# EAGLE design ardu_heli_small (EAGLE 5.06)
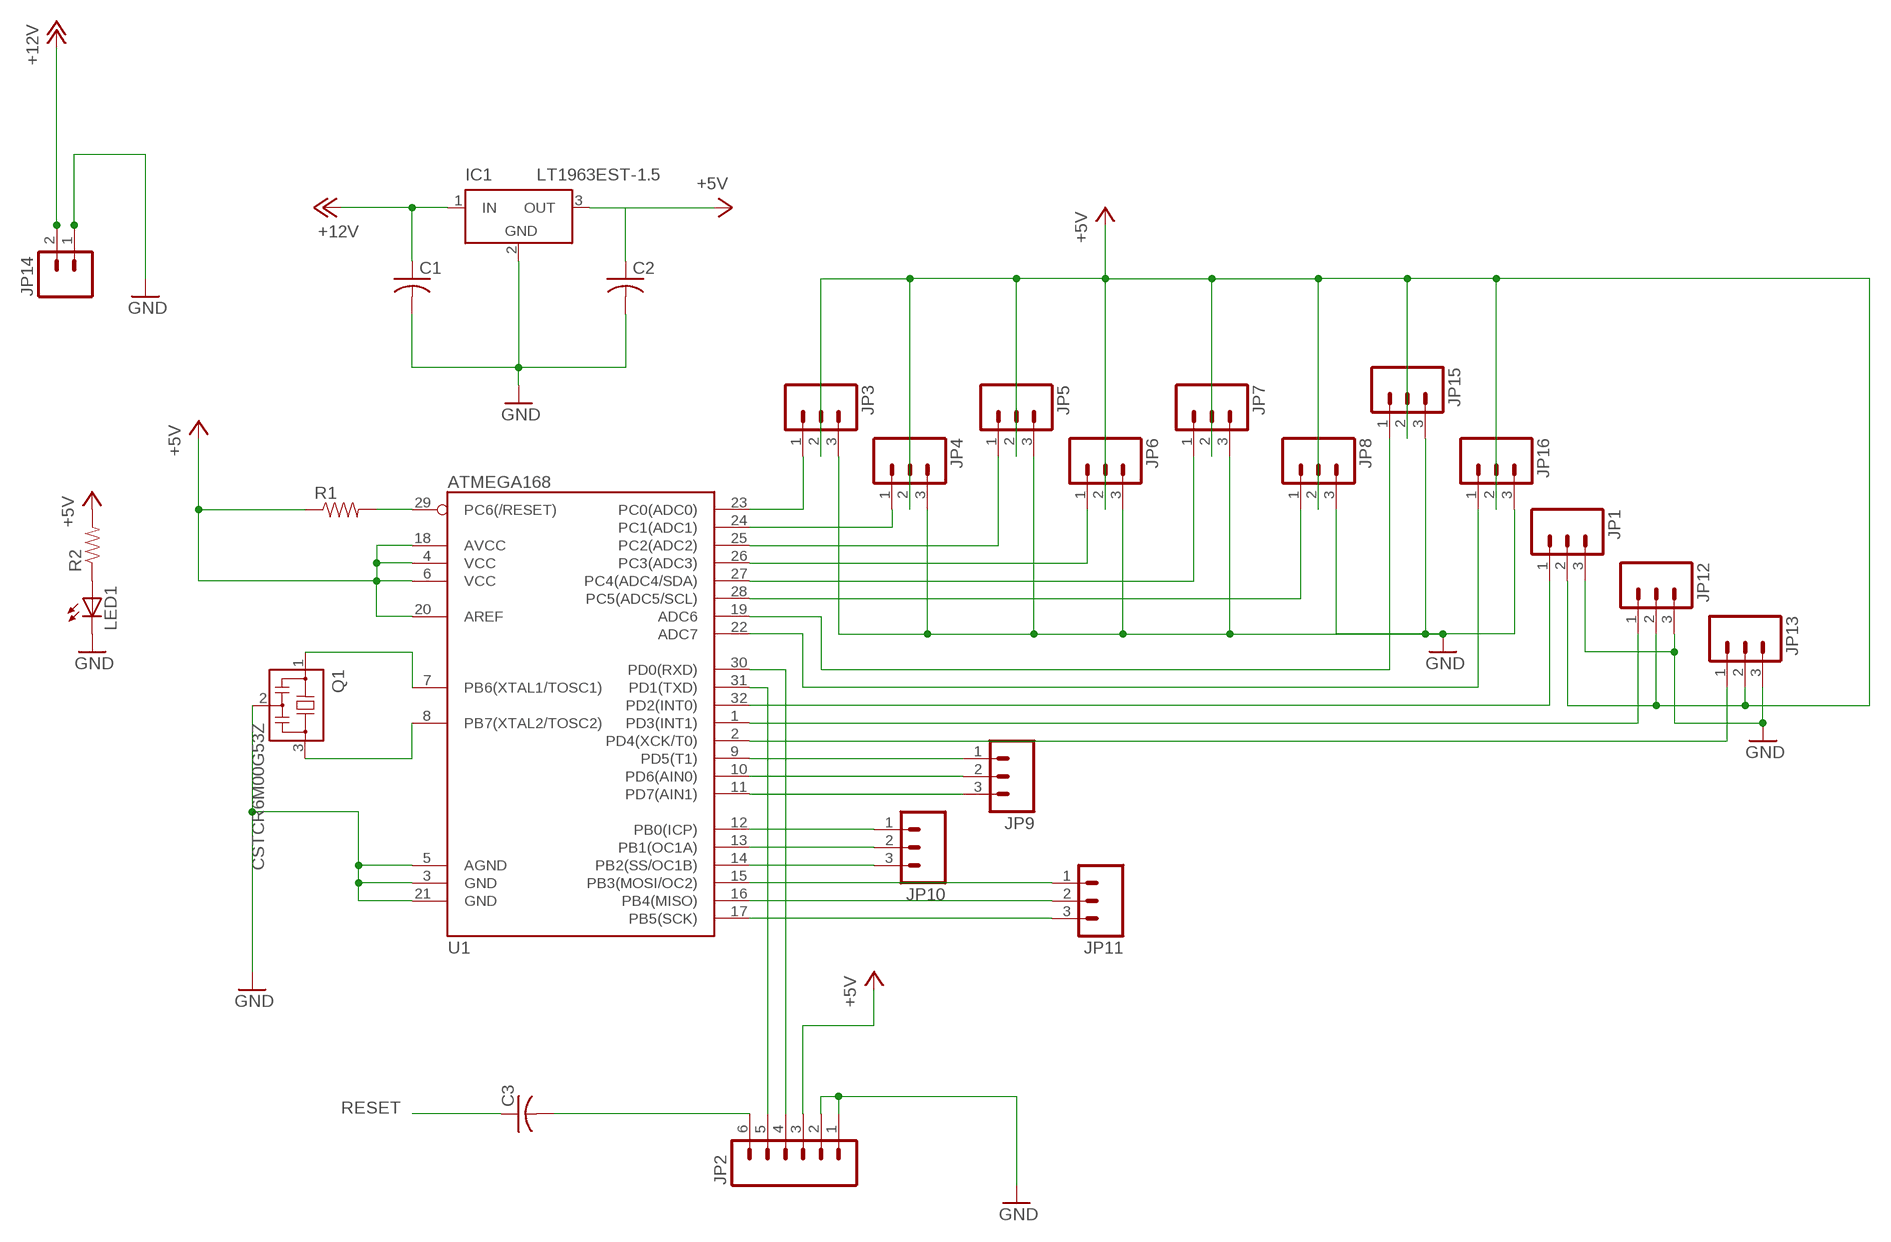
[diagram p0: schematic, sheet 1]

## Parts
C1  C-USC1206  [C1206]
C2  C-USC1206  [C1206]
C3  C-USC1812K  [C1812K]
IC1  LT1963EST-1.5  [SOT223]
JP1  M03PTH  [1X03]
JP2  M06SIP  [1X06]
JP3  M03PTH  [1X03]
JP4  M03PTH  [1X03]
JP5  M03PTH  [1X03]
JP6  M03PTH  [1X03]
JP7  M03PTH  [1X03]
JP8  M03PTH  [1X03]
JP9  M03PTH  [1X03]
JP10  M03PTH  [1X03]
JP11  M03PTH  [1X03]
JP12  M03PTH  [1X03]
JP13  M03PTH  [1X03]
JP14  M02PTH  [1X02]
JP15  M03PTH  [1X03]
JP16  M03PTH  [1X03]
LED1  LED1206  [LED-1206]
Q1  CSTCR6M00G53Z  [CSTCR6M]
R1  RESISTOR1206  [1206]
R2  RESISTOR1206  [1206]
U1  ATMEGA168  [TQFP32-08]

## Nets
+5V: C2.1 IC1.3(OUT) JP1.2 JP2.3 JP3.2 JP4.2 JP5.2 JP6.2 JP7.2 JP8.2 JP12.2 JP13.2 JP15.2 JP16.2 R1.1 R2.2 U1.4(VCC) U1.6(VCC) U1.18(AVCC) U1.20(AREF)
+12V: C1.1 IC1.1(IN) JP14.2
GND: C1.2 C2.2 IC1.2(GND) JP1.3 JP2.1 JP2.2 JP3.3 JP4.3 JP5.3 JP6.3 JP7.3 JP8.3 JP12.3 JP13.3 JP14.1 JP15.3 JP16.3 LED1.C Q1.2 U1.3(GND) U1.5(AGND) U1.21(GND)
N$1: Q1.3 U1.8(PB7(XTAL2/TOSC2))
N$2: Q1.1 U1.7(PB6(XTAL1/TOSC1))
N$3: JP3.1 U1.23(PC0(ADC0))
N$4: JP4.1 U1.24(PC1(ADC1))
N$5: JP2.4 U1.30(PD0(RXD))
N$6: JP12.1 U1.1(PD3(INT1))
N$7: JP2.5 U1.31(PD1(TXD))
N$8: JP1.1 U1.32(PD2(INT0))
N$9: JP5.1 U1.25(PC2(ADC2))
N$10: JP6.1 U1.26(PC3(ADC3))
N$11: JP7.1 U1.27(PC4(ADC4/SDA))
N$12: JP8.1 U1.28(PC5(ADC5/SCL))
N$14: JP13.1 U1.2(PD4(XCK/T0))
N$15: JP9.1 U1.9(PD5(T1))
N$16: JP9.2 U1.10(PD6(AIN0))
N$17: JP9.3 U1.11(PD7(AIN1))
N$18: JP10.1 U1.12(PB0(ICP))
N$19: JP10.2 U1.13(PB1(OC1A))
N$20: JP10.3 U1.14(PB2(SS/OC1B))
N$21: JP11.1 U1.15(PB3(MOSI/OC2))
N$22: JP11.2 U1.16(PB4(MISO))
N$23: JP11.3 U1.17(PB5(SCK))
N$24: LED1.A R2.1
N$28: C3.2 JP2.6
N$31: JP15.1 U1.19(ADC6)
N$33: JP16.1 U1.22(ADC7)
RESET: C3.1 R1.2 U1.29(PC6(/RESET))

## Power pins joined to a net without a drawn wire
GND: IC1.4(GND)

## Library data of the parts
C1-C3 = rcl:C-US: CAPACITOR, American symbol
IC1 = linear-technology:LT1963EST: 1.5A, Low Noise, Fast Transient Response LDO Regulator Source: http://www.linear.com/pc/downloadDocument.do?navId=H0,C3,P2222,D3148
JP1 JP3-JP13 JP15 JP16 = SparkFun:M03: Header 3 Standard 3-pin 0.1" header. Use with straight break away headers (SKU : PRT-00116), right angle break away headers (PRT-00553), swiss pins (PRT-00743), machine pins (PRT-00117), and female headers (PRT-00115). Molex polarized connector foot print use with SKU : PRT-08232 with associated crimp pins and housings.
JP2 = SparkFun:M06: Header 6 Standard 6-pin 0.1" header. Use with straight break away headers (SKU : PRT-00116), right angle break away headers (PRT-00553), swiss pins (PRT-00743), machine pins (PRT-00117), and female headers (PRT-00115). Molex polarized connector foot print use with SKU : PRT-08094 with associated crimp pins and housings. NOTES ON THE VARIANTS LOCK and LOCK_LONGPADS... This footprint was designed to help hold the alignment of a through-hole component (i.e. 6-pin header) while soldering it into place. You may notice that each hole has been shifted either up or down by 0.005 of an inch from it's more standard position (which is a perfectly straight line). This slight alteration caused the pins (the squares in the middle) to touch the edges of the holes. Because they are alternating, it causes a "brace" to hold the component in place. 0.005 has proven to be the perfect amount of "off-center" position when using our standard breakaway headers. Although looks a little odd when you look at the bare footprint, once you have a header in there, the alteration is very hard to notice. Also, if you push a header all the way into place, it is covered up entirely on the bottom side. This idea of altering the position of holes to aid alignment will be further integrated into the Sparkfun Library for other footprints. It can help hold any component with 3 or more connection pins.
JP14 = SparkFun:M02: Header 2 Standard 2-pin 0.1" header. Use with straight break away headers (SKU : PRT-00116), right angle break away headers (PRT-00553), swiss pins (PRT-00743), machine pins (PRT-00117), and female headers (PRT-00115). Molex polarized connector foot print use with SKU : PRT-08233 with associated crimp pins and housings.
LED1 = SparkFun:LED: LEDs Standard schematic elements and footprints for 5mm, 3mm, 1206, and 0603 sized LEDs. 5mm - Spark Fun Electronics SKU : COM-00529 (and others)
Q1 = murata-filter:CSTCR: Resonator Source: murata.co.jp
R1 R2 = SparkFun:RESISTOR: Resistor Basic schematic elements and footprints for 0603, 1206, and PTH 1/10th watt (small) resistors.
U1 = SparkFun:ATMEGA168

## Board
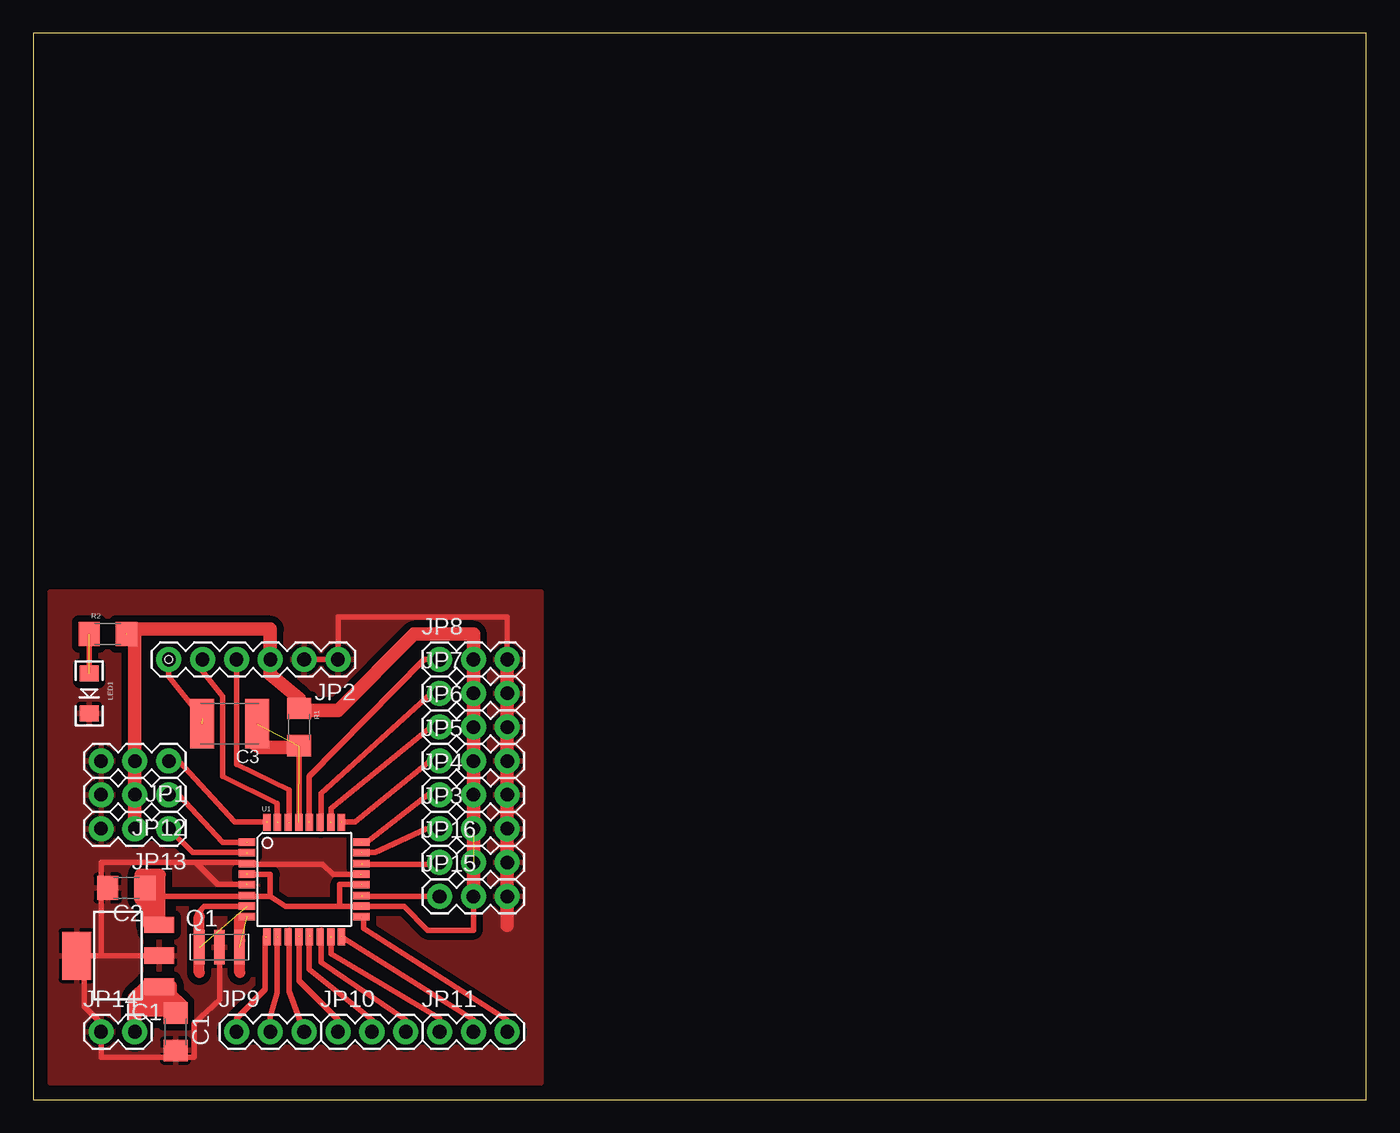
[diagram p1: board, top side]

Size 100 x 80 mm. Coordinates in mm from the lower left corner, seen from the top.
Outline: 0,0 100,0 100,80 0,80 0,0
Copper layers (1*16): Top 0.035mm / dielectric 1.5mm / Bottom 0.035mm
Design rules "default *": minimum track width 10mil, minimum drill 24mil, track to track 20mil, track to pad 20mil, pad to pad 8mil, via to via 8mil, smd to smd 8mil, copper to edge 40mil, drill to drill 8mil, minimum pad ring 10mil, minimum via ring 8mil, stop-mask expansion 4mil, vias tented up to drill 0mil, thermal gap 10mil
Holes 0.6 mm at 10.16,33.02

### Footprints (pad centres in the part's own frame; a part is rotated, then mirrored left to right if it is on the bottom)
C1206 = smd 1.6 x 1.8: 1 -1.4,0; 2 1.4,0
C1812K = smd 1.8 x 3.7: 1 -2.05,0; 2 2.05,0
SOT223 = smd 1.219 x 2.235: 1 -2.311,-3.099; 2 0,-3.099; 3 2.311,-3.099 | smd 3.6 x 2.2: 4 0,3.099
1X03 = drill 1.016 pad 1.88 round: 1 0,0; 2 2.54,0; 3 5.08,0
1X06 = drill 1.016 pad 1.88 round: 1 0,0; 2 2.54,0; 3 5.08,0; 4 7.62,0; 5 10.16,0; 6 12.7,0
1X02 = drill 1.016 pad 1.88 round: 1 0,0; 2 2.54,0
LED-1206 = smd 1.2 x 1.4: A -1.5,0; C 1.5,0
CSTCR6M = smd 0.8 x 2.6: 1 -1.5,0; 2 0,0; 3 1.5,0
1206 = smd 1.6 x 1.8: 1 -1.4,0; 2 1.4,0
TQFP32-08 = smd 1.27 x 0.559: 1 -4.293,2.8; 2 -4.293,2; 3 -4.293,1.2; 4 -4.293,0.4; 5 -4.293,-0.4; 6 -4.293,-1.2; 7 -4.293,-2; 8 -4.293,-2.8; 17 4.293,-2.8; 18 4.293,-2; 19 4.293,-1.2; 20 4.293,-0.4; 21 4.293,0.4; 22 4.293,1.2; 23 4.293,2; 24 4.293,2.8 | smd 0.559 x 1.27: 9 -2.8,-4.293; 10 -2,-4.293; 11 -1.2,-4.293; 12 -0.4,-4.293; 13 0.4,-4.293; 14 1.2,-4.293; 15 2,-4.293; 16 2.8,-4.293; 25 2.8,4.293; 26 2,4.293; 27 1.2,4.293; 28 0.4,4.293; 29 -0.4,4.293; 30 -1.2,4.293; 31 -2,4.293; 32 -2.8,4.293

### Placement (x,y rotation side)
C1  10.67,5.08 270 top
C2  6.99,15.88 180 top
C3  14.73,28.19 180 top
IC1  6.35,10.79 90 top
JP1  10.16,25.4 180 top
JP2  22.86,33.02 180 top
JP3  30.48,20.32 0 top
JP4  30.48,22.86 0 top
JP5  30.48,25.4 0 top
JP6  30.48,27.94 0 top
JP7  30.48,30.48 0 top
JP8  30.48,33.02 0 top
JP9  15.24,5.08 0 top
JP10  22.86,5.08 0 top
JP11  30.48,5.08 0 top
JP12  10.16,22.86 180 top
JP13  10.16,20.32 180 top
JP14  5.08,5.08 0 top
JP15  30.48,15.24 0 top
JP16  30.48,17.78 0 top
LED1  4.19,30.48 270 top
Q1  13.97,11.43 0 top
R1  19.94,27.94 270 top
R2  5.59,34.92 0 top
U1  20.32,16.51 0 top

### Tracks (layer width: path | path; a pad name or v marks a point on that pad's centre or on a via)
+5V  (5 unrouted)
  Top 0.406: 9.4,15.24 16.51,15.24 | 9.4,15.24 8.89,15.88 C2.1 | 9.4,15.24 9.4,13.34 IC1.3 | R1.1 20.32,29.21 20.57,29.21 20.45,29.34 R1.1 19.56,29.72 19.56,29.59 19.43,29.72 19.94,29.46 | 16.51,15.24 17.78,15.24 | 16.51,15.24 U1.6 | JP3.2 JP15.2 33.02,12.7 29.59,12.7 27.81,14.48 24.64,14.48 22.99,14.48 | 17.78,15.24 18.92,14.48 22.99,14.48 | 16,16.89 17.78,16.89 17.78,15.24 | 24.64,16.13 22.99,16.13 22.99,14.48 | 7.62,35.31 7.37,35.31 R2.2
  Top 1.016: 19.94,29.46 19.94,30.1 17.78,31.88 JP2.3 17.78,35.31 7.62,35.31 JP1.2 JP12.2 JP13.2 | 20.57,29.21 22.86,29.21 28.57,34.92 33.02,34.92 JP8.2 JP7.2 JP6.2 JP5.2 JP4.2 JP3.2 JP15.2
+12V
  Top 0.406: 8.89,8.26 8.89,8.89 IC1.1 | 10.29,6.73 10.54,6.48 C1.1
  Top 1.016: 7.62,6.73 8.89,8.26 7.62,6.99 7.62,6.86 | 7.62,6.73 10.29,6.73 | JP14.2 7.62,6.73 | 7.62,6.73 7.62,6.86 | 7.62,6.86 7.62,7.62 8.51,8.51 10.29,8.51 10.29,7.87 11.05,7.11 11.05,6.99 10.92,6.86 9.27,6.86 8.64,7.49 9.27,7.49 9.4,7.62 9.53,7.62 9.78,7.37
GND  (2 unrouted)
  Top 0.406: 12.19,17.78 5.08,17.78 5.08,16.51 | 12.19,17.78 16.51,17.78 | 16.51,17.78 U1.3 | 3.81,10.79 5.08,10.79 | 5.08,10.79 IC1.2 | 3.81,10.79 IC1.4 | Q1.2 13.97,7.49 12.06,5.71 12.06,3.17 5.08,3.17 JP14.1 5.08,5.71 3.81,6.99 3.81,10.79 | 5.08,10.79 5.08,16.51 | 5.08,16.51 C2.2 | 16,16.13 13.84,16.13 12.19,17.78 | 24.51,16.89 22.48,16.89 21.72,17.65 17.14,17.65 | 17.14,17.65 16.38,17.65 | 17.14,17.65 16.64,17.65 16.51,17.78 | JP2.2 JP2.1 22.86,36.2 35.56,36.2 JP8.3
  Top 1.016: JP8.3 JP7.3 JP6.3 JP5.3 JP4.3 JP3.3 35.56,13.08
  pour Top: 1.27,38.1 1.27,1.27 38.1,1.27 38.1,38.1
N$1  (1 unrouted)
N$2  (1 unrouted)
N$3  (1 unrouted)
  Top 0.406: 24.64,18.54 25.65,18.54 29.46,20.32 JP3.1
N$4  (1 unrouted)
  Top 0.406: 24.64,19.3 25.02,19.3 29.59,22.86 JP4.1
N$5  (1 unrouted)
  Top 0.406: 19.18,20.83 19.18,23.24 15.24,25.15 JP2.4 15.24,33.15
N$6  (1 unrouted)
  Top 0.406: JP12.1 10.92,22.86 14.22,19.3 16,19.3
N$7  (1 unrouted)
  Top 0.406: JP2.5 12.7,32.13 14.22,30.23 14.22,24.26 18.29,22.23 18.29,20.83
N$8  (1 unrouted)
  Top 0.406: 17.53,20.83 15.11,20.83 10.92,25.4 JP1.1
N$9  (1 unrouted)
  Top 0.406: 23.11,20.83 24.13,20.83 29.59,25.27 JP5.1
N$10  (1 unrouted)
  Top 0.406: 22.35,20.83 22.35,21.84 29.84,27.94 JP6.1
N$11
  Top 0.406: JP7.1 29.84,30.48 21.59,22.99 21.59,20.32 U1.27
N$12  (1 unrouted)
  Top 0.406: 20.7,20.83 20.7,24.26 29.34,33.02 JP8.1
N$13
  Top 0.813: 8.89,13.08 8.64,13.08 8.64,14.35 8,14.99 8,16.89 9.53,16.89 9.53,13.59 9.14,13.59 9.14,14.61 8.64,15.11
N$14  (1 unrouted)
  Top 0.406: 16,18.54 11.94,18.54 JP13.1
N$15  (1 unrouted)
  Top 0.406: 17.4,12.19 17.4,8.26 15.24,6.1 JP9.1
N$16  (1 unrouted)
  Top 0.406: JP9.2 17.78,6.22 18.29,8 18.29,12.19
N$17
  Top 0.406: JP9.3 19.18,8.13 19.18,12.7 U1.11
N$18  (1 unrouted)
  Top 0.406: 19.94,12.19 19.94,8.89 22.86,5.97 JP10.1
N$19  (1 unrouted)
  Top 0.406: 20.7,12.32 20.7,9.78 25.4,5.97 JP10.2
N$20
  Top 0.406: JP10.3 27.94,5.97 21.59,10.29 21.59,12.7 U1.14
N$21  (1 unrouted)
  Top 0.406: 22.35,12.19 22.35,10.92 30.48,6.1 JP11.1
N$22  (1 unrouted)
  Top 0.406: 23.11,12.19 23.24,12.06 23.37,12.06 33.02,5.97 JP11.2
N$23  (1 unrouted)
  Top 0.406: 24.64,13.72 24.77,13.59 24.77,12.83 35.56,5.97 JP11.3
N$24  (1 unrouted)
N$25
  Top 0.406: 12.45,13.97 12.45,14.1 12.83,14.48 16,14.48
  Top 0.61: 12.45,13.72 12.45,13.97
  Top 0.813: 12.45,9.53 12.45,13.72
N$26
  Top 0.406: 15.49,11.43 15.62,11.43 15.62,13.72 | 15.49,11.43 15.49,11.94 15.49,12.06 15.62,13.72 | 15.62,13.72 16,13.72 | 15.49,9.4 15.49,9.53 15.49,11.43
  Top 0.813: 15.49,13.59 15.49,11.94 15.49,9.53
N$27
  Top 0.406: 19.91,21.31 19.91,21.34 19.93,21.35 19.93,21.36 19.94,21.37 | 19.94,26.42 19.94,26.52 | 19.94,26.52 19.94,26.54 | 19.94,22.61 19.94,21.37 | 19.94,21.37 19.94,21.34 | 19.94,21.34 19.94,20.7 | 19.91,21.31 19.91,20.8 | 19.94,21.34 19.91,21.31 | 19.94,22.61 19.94,21.34 | 19.94,22.61 19.94,26.42 | 19.94,26.54 19.93,26.54 | 19.93,26.54 19.91,26.54 19.91,26.52 19.94,26.52 | 19.96,26.53 19.96,26.54 19.95,26.56 19.94,26.56 19.93,26.54 | 19.94,26.42 19.94,26.54
  Top 1.016: 19.94,26.42 17.02,26.42 16.51,26.8 16.51,27.3
N$28  (1 unrouted)
  Top 0.406: 12.7,28.57 10.16,31.75 JP2.6
N$29
  Top 0.406: 4.19,31.88 4.19,32 4.19,34.92
N$31  (1 unrouted)
  Top 0.406: 24.64,15.24 JP15.1
N$33  (1 unrouted)
  Top 0.406: 24.64,17.65 30.35,17.65 JP16.1
RESET  (2 unrouted)